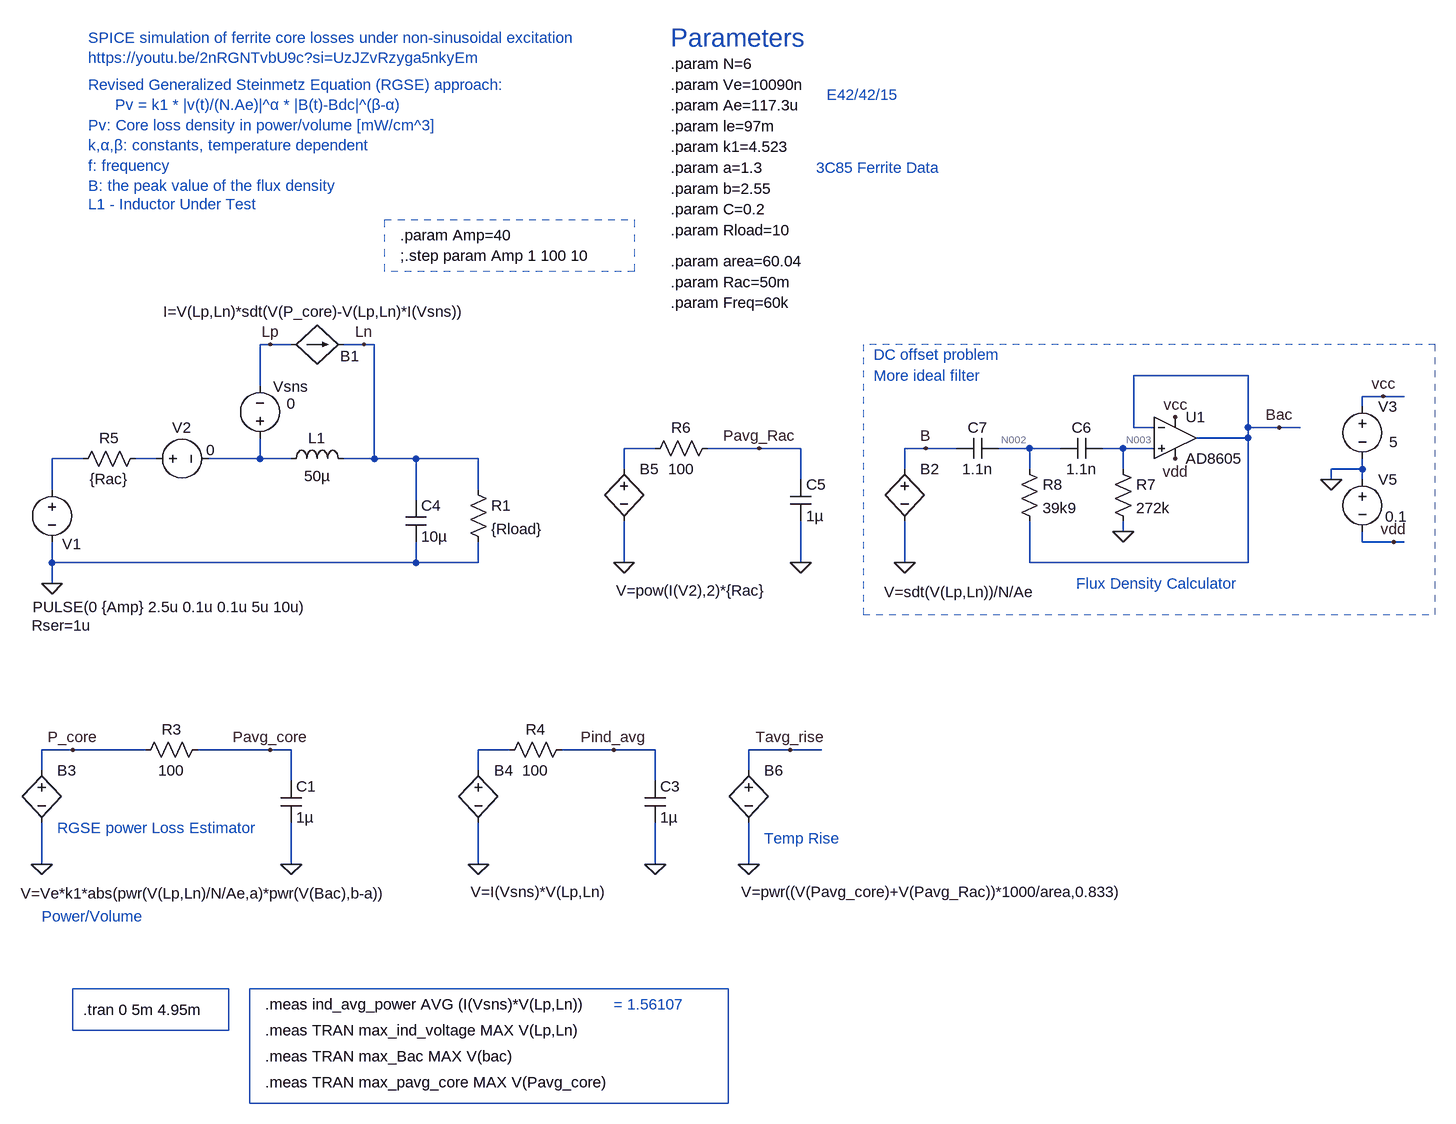
[diagram p0: schematic 08-ferrite_core_loss_max_temp_non-sinsoidal_buck.asc]
08-ferrite_core_loss_max_temp_non-sinsoidal_buck.asc, the LTspice schematic file:
Version 4
SHEET 1 2440 1828
WIRE 144 656 128 656
WIRE 176 656 144 656
WIRE 288 656 256 656
WIRE 304 656 288 656
WIRE 1648 704 1472 704
WIRE 128 720 128 656
WIRE 1856 736 1824 736
WIRE 1888 736 1856 736
WIRE 1824 752 1824 736
WIRE 1472 784 1472 704
WIRE 1504 784 1472 784
WIRE 1648 784 1648 704
WIRE 1696 784 1648 784
WIRE 1728 784 1696 784
WIRE 1648 800 1648 784
WIRE 1648 800 1568 800
WIRE 736 816 688 816
WIRE 896 816 816 816
WIRE 960 816 896 816
WIRE 1152 816 1120 816
WIRE 1200 816 1152 816
WIRE 1312 816 1264 816
WIRE 1360 816 1312 816
WIRE 1456 816 1424 816
WIRE 1504 816 1456 816
WIRE -144 832 -192 832
WIRE -32 832 -64 832
WIRE 128 832 128 800
WIRE 128 832 48 832
WIRE 176 832 128 832
WIRE 304 832 304 656
WIRE 304 832 256 832
WIRE 368 832 304 832
WIRE 464 832 368 832
WIRE 688 848 688 816
WIRE 1120 848 1120 816
WIRE 1312 848 1312 816
WIRE 1456 848 1456 816
WIRE 1824 848 1824 832
WIRE 1824 848 1776 848
WIRE 960 864 960 816
WIRE 1776 864 1776 848
WIRE 1824 864 1824 848
WIRE -192 880 -192 832
WIRE 464 880 464 832
WIRE 368 896 368 832
WIRE 1456 944 1456 928
WIRE 1824 960 1824 944
WIRE 1872 960 1824 960
WIRE 1888 960 1872 960
WIRE -192 992 -192 960
WIRE 368 992 368 960
WIRE 368 992 -192 992
WIRE 464 992 464 960
WIRE 464 992 368 992
WIRE 688 992 688 928
WIRE 960 992 960 928
WIRE 1120 992 1120 928
WIRE 1312 992 1312 928
WIRE 1648 992 1648 800
WIRE 1648 992 1312 992
WIRE -192 1024 -192 992
WIRE -160 1280 -208 1280
WIRE -48 1280 -160 1280
WIRE 144 1280 32 1280
WIRE 176 1280 144 1280
WIRE 512 1280 464 1280
WIRE 672 1280 592 1280
WIRE 736 1280 672 1280
WIRE 944 1280 880 1280
WIRE 992 1280 944 1280
WIRE -208 1312 -208 1280
WIRE 464 1312 464 1280
WIRE 880 1312 880 1280
WIRE 176 1328 176 1280
WIRE 736 1328 736 1280
WIRE -208 1456 -208 1392
WIRE 176 1456 176 1392
WIRE 464 1456 464 1392
WIRE 736 1456 736 1392
WIRE 880 1456 880 1392
FLAG -192 1024 0
FLAG -208 1456 0
FLAG -160 1280 P_core
FLAG 1120 992 0
FLAG 1696 784 Bac
FLAG 144 656 Lp
FLAG 288 656 Ln
FLAG 144 1280 Pavg_core
FLAG 176 1456 0
FLAG 1152 816 B
FLAG 464 1456 0
FLAG 672 1280 Pind_avg
FLAG 736 1456 0
FLAG 688 992 0
FLAG 896 816 Pavg_Rac
FLAG 960 992 0
FLAG 880 1456 0
FLAG 944 1280 Tavg_rise
FLAG 1856 736 vcc
FLAG 1536 768 vcc
FLAG 1456 944 0
FLAG 1776 864 0
FLAG 1872 960 vdd
FLAG 1536 832 vdd
SYMBOL voltage -192 864 R0
WINDOW 0 16 99 Left 2
WINDOW 3 -30 196 Left 2
WINDOW 123 0 0 Left 0
WINDOW 39 -31 225 Left 2
SYMATTR InstName V1
SYMATTR Value PULSE(0 {Amp} 2.5u 0.1u 0.1u 5u 10u)
SYMATTR SpiceLine Rser=1u
SYMBOL ind 160 848 R270
WINDOW 0 32 56 VTop 2
WINDOW 3 5 56 VBottom 2
SYMATTR InstName L1
SYMATTR Value 50µ
SYMATTR SpiceLine Rser=1
SYMBOL bv -208 1296 R0
WINDOW 3 -32 205 Left 2
SYMATTR Value V=Ve*k1*abs(pwr(V(Lp,Ln)/N/Ae,a)*pwr(V(Bac),b-a))
SYMATTR InstName B3
SYMBOL bv 1120 832 R0
WINDOW 3 -32 205 Left 2
SYMATTR Value V=sdt(V(Lp,Ln))/N/Ae
SYMATTR InstName B2
SYMBOL bi 176 656 R270
WINDOW 0 -34 90 VTop 2
WINDOW 3 66 37 VBottom 2
SYMATTR InstName B1
SYMATTR Value I=V(Lp,Ln)*sdt(V(P_core)-V(Lp,Ln)*I(Vsns))
SYMBOL res 48 1264 R90
WINDOW 0 0 56 VBottom 2
WINDOW 3 32 56 VTop 2
SYMATTR InstName R3
SYMATTR Value 100
SYMBOL cap 160 1328 R0
SYMATTR InstName C1
SYMATTR Value 1µ
SYMBOL bv 464 1296 R0
WINDOW 3 -12 203 Left 2
SYMATTR Value V=I(Vsns)*V(Lp,Ln)
SYMATTR InstName B4
SYMBOL res 608 1264 R90
WINDOW 0 0 56 VBottom 2
WINDOW 3 32 56 VTop 2
SYMATTR InstName R4
SYMATTR Value 100
SYMBOL cap 720 1328 R0
SYMATTR InstName C3
SYMATTR Value 1µ
SYMBOL voltage 128 816 R180
WINDOW 0 -74 95 Left 2
WINDOW 3 -55 69 Left 2
SYMATTR InstName Vsns
SYMATTR Value 0
SYMBOL cap 352 896 R0
SYMATTR InstName C4
SYMATTR Value 10µ
SYMBOL res 448 864 R0
SYMATTR InstName R1
SYMATTR Value {Rload}
SYMBOL res -48 816 R90
WINDOW 0 0 56 VBottom 2
WINDOW 3 32 56 VTop 2
SYMATTR InstName R5
SYMATTR Value {Rac}
SYMBOL voltage -48 832 R270
WINDOW 0 32 56 VTop 2
WINDOW 3 29 100 VBottom 2
SYMATTR InstName V2
SYMATTR Value 0
SYMBOL bv 688 832 R0
WINDOW 3 -12 203 Left 2
SYMATTR Value V=pow(I(V2),2)*{Rac}
SYMATTR InstName B5
SYMBOL res 832 800 R90
WINDOW 0 0 56 VBottom 2
WINDOW 3 32 56 VTop 2
SYMATTR InstName R6
SYMATTR Value 100
SYMBOL cap 944 864 R0
SYMATTR InstName C5
SYMATTR Value 1µ
SYMBOL bv 880 1296 R0
WINDOW 3 -12 203 Left 2
SYMATTR Value V=pwr((V(Pavg_core)+V(Pavg_Rac))*1000/area,0.833)
SYMATTR InstName B6
SYMBOL voltage 1824 736 R0
WINDOW 3 41 70 Left 2
WINDOW 123 0 0 Left 0
WINDOW 39 0 0 Left 0
SYMATTR InstName V3
SYMATTR Value 5
SYMBOL res 1440 832 R0
SYMATTR InstName R7
SYMATTR Value 272k
SYMBOL cap 1424 800 R90
WINDOW 0 0 32 VBottom 2
WINDOW 3 32 32 VTop 2
SYMATTR InstName C6
SYMATTR Value 1.1n
SYMBOL res 1296 832 R0
SYMATTR InstName R8
SYMATTR Value 39k9
SYMBOL cap 1264 800 R90
WINDOW 0 0 32 VBottom 2
WINDOW 3 32 32 VTop 2
SYMATTR InstName C7
SYMATTR Value 1.1n
SYMBOL voltage 1824 848 R0
WINDOW 3 35 73 Left 2
WINDOW 123 0 0 Left 0
WINDOW 39 0 0 Left 0
SYMATTR InstName V5
SYMATTR Value 0.1
SYMBOL OpAmps\\AD8605 1536 736 R0
SYMATTR InstName U1
TEXT -136 184 Left 2 ;SPICE simulation of ferrite core losses under non-sinusoidal excitation\nhttps://youtu.be/2nRGNTvbU9c?si=UzJZvRzyga5nkyEm
TEXT -136 256 Left 2 ;Revised Generalized Steinmetz Equation (RGSE) approach:\n      Pv = k1 * |v(t)/(N.Ae)|^α * |B(t)-Bdc|^(β-α)\nPv: Core loss density in power/volume [mW/cm^3]\nk,α,β: constants, temperature dependent\nf: frequency\nB: the peak value of the flux density
TEXT 760 224 Left 2 !.param N=6
TEXT 760 184 Left 4 ;Parameters
TEXT 760 256 Left 2 !.param Ve=10090n
TEXT 760 288 Left 2 !.param Ae=117.3u
TEXT 760 320 Left 2 !.param le=97m
TEXT 760 352 Left 2 !.param k1=4.523
TEXT 760 384 Left 2 !.param a=1.3
TEXT 760 416 Left 2 !.param b=2.55
TEXT 344 488 Left 2 !.param Amp=40\n;.step param Amp 1 100 10
TEXT 1000 272 Left 2 ;E42/42/15
TEXT 984 384 Left 2 ;3C85 Ferrite Data
TEXT -144 1680 Left 2 !.tran 0 5m 4.95m
TEXT -184 1400 Left 2 ;RGSE power Loss Estimator
TEXT 1384 1024 Left 2 ;Flux Density Calculator
TEXT -208 1536 Left 2 ;Power/Volume
TEXT -136 440 Left 2 ;L1 - Inductor Under Test
TEXT 136 1672 Left 2 !.meas ind_avg_power AVG (I(Vsns)*V(Lp,Ln))
TEXT 672 1672 Left 2 ;= 1.56107
TEXT 136 1712 Left 2 !.meas TRAN max_ind_voltage MAX V(Lp,Ln)
TEXT 136 1752 Left 2 !.meas TRAN max_Bac MAX V(bac)
TEXT 136 1792 Left 2 !.meas TRAN max_pavg_core MAX V(Pavg_core)
TEXT 760 448 Left 2 !.param C=0.2
TEXT 760 480 Left 2 !.param Rload=10
TEXT 760 528 Left 2 !.param area=60.04
TEXT 760 560 Left 2 !.param Rac=50m
TEXT 760 592 Left 2 !.param Freq=60k
TEXT 904 1416 Left 2 ;Temp Rise
TEXT 1072 672 Left 2 ;DC offset problem
TEXT 1072 704 Left 2 ;More ideal filter
RECTANGLE Normal 80 1712 -160 1648
RECTANGLE Normal 848 1824 112 1648
RECTANGLE Normal 704 544 320 464 1
RECTANGLE Normal 1056 1072 1936 656 2

The netlist it stands for:
* 08-ferrite_core_loss_max_temp_non-sinsoidal_buck.asc
V1 N004 0 PULSE(0 {Amp} 2.5u 0.1u 0.1u 5u 10u) Rser=1u
L1 N006 Ln 50µ Rser=1
B3 P_core 0 V=Ve*k1*abs(pwr(V(Lp,Ln)/N/Ae,a)*pwr(V(Bac),b-a))
B2 B 0 V=sdt(V(Lp,Ln))/N/Ae
B1 Lp Ln I=V(Lp,Ln)*sdt(V(P_core)-V(Lp,Ln)*I(Vsns))
R3 Pavg_core P_core 100
C1 Pavg_core 0 1µ
B4 N007 0 V=I(Vsns)*V(Lp,Ln)
R4 Pind_avg N007 100
C3 Pind_avg 0 1µ
Vsns N006 Lp 0
C4 Ln 0 10µ
R1 Ln 0 {Rload}
R5 N005 N004 {Rac}
V2 N005 N006 0
B5 N001 0 V=pow(I(V2),2)*{Rac}
R6 Pavg_Rac N001 100
C5 Pavg_Rac 0 1µ
B6 Tavg_rise 0 V=pwr((V(Pavg_core)+V(Pavg_Rac))*1000/area,0.833)
V3 vcc 0 5
R7 N003 0 272k
C6 N003 N002 1.1n
R8 N002 Bac 39k9
C7 N002 B 1.1n
V5 0 vdd 0.1
XU1 N003 Bac vcc vdd Bac AD8605  ; pins In+ In- V+ V- OUT
* SPICE simulation of ferrite core losses under non-sinusoidal excitation
* https://youtu.be/2nRGNTvbU9c?si=UzJZvRzyga5nkyEm
* Revised Generalized Steinmetz Equation (RGSE) approach:
*       Pv = k1 * |v(t)/(N.Ae)|^α * |B(t)-Bdc|^(β-α)
* Pv: Core loss density in power/volume [mW/cm^3]
* k,α,β: constants, temperature dependent
* f: frequency
* B: the peak value of the flux density
.param N=6
* Parameters
.param Ve=10090n
.param Ae=117.3u
.param le=97m
.param k1=4.523
.param a=1.3
.param b=2.55
.param Amp=40
;.step param Amp 1 100 10
* E42/42/15
* 3C85 Ferrite Data
.tran 0 5m 4.95m
* RGSE power Loss Estimator
* Flux Density Calculator
* Power/Volume
* L1 - Inductor Under Test
.meas ind_avg_power AVG (I(Vsns)*V(Lp,Ln))
* = 1.56107
.meas TRAN max_ind_voltage MAX V(Lp,Ln)
.meas TRAN max_Bac MAX V(bac)
.meas TRAN max_pavg_core MAX V(Pavg_core)
.param C=0.2
.param Rload=10
.param area=60.04
.param Rac=50m
.param Freq=60k
* Temp Rise
* DC offset problem
* More ideal filter
.lib ADI.lib
.backanno
.end

* Results of the author's LTspice run, read from the files saved beside the schematic
* Operating Point, zero values left out:
*   V(vcc) = 5 V
*   V(n003) = -13.6 nV
*   V(n002) = -105.2 µV
*   V(bac) = -105.2 µV
*   V(vdd) = -100 mV
*   I(V3) = -492.8 µA
*   I(V5) = -492.8 µA
*   Ix(u1:99) = 492.8 µA
*   Ix(u1:50) = -492.8 µA
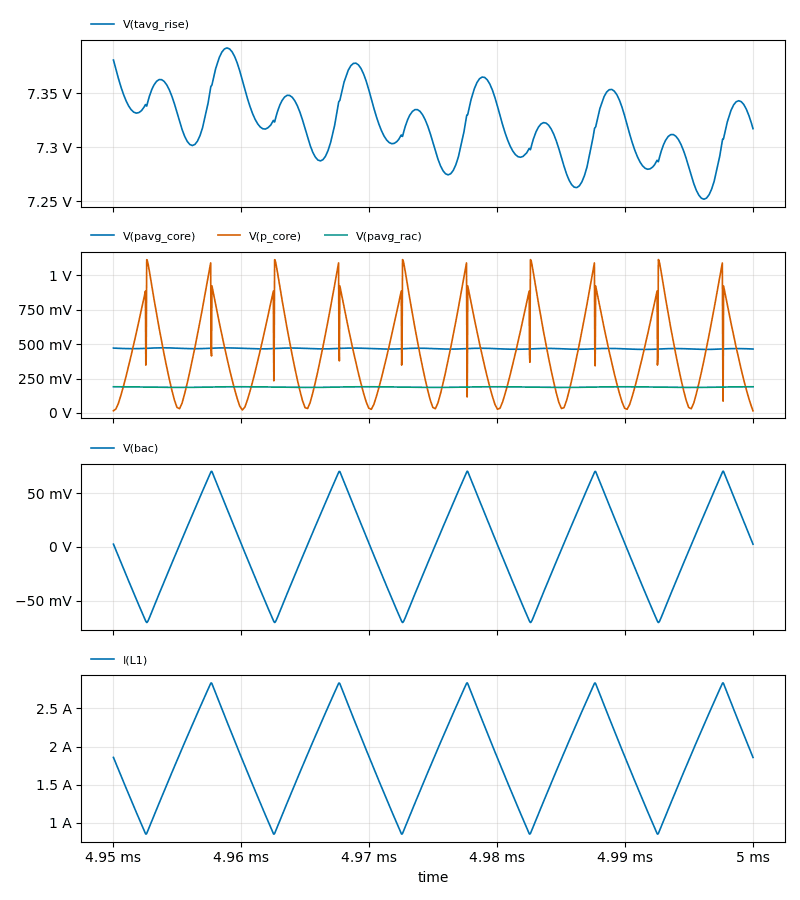
[diagram p1: Transient Analysis of 08-ferrite_core_loss_max_temp_non-sinsoidal_buck.asc, plotted from the saved traces]
* Transient Analysis, 1 run:
*   V(tavg_rise): min 7.252 V, max 7.392 V, average 7.321 V, rms 7.322 V, last 7.317 V
*   V(pavg_core): min 461.8 mV, max 473.4 mV, average 467.4 mV, rms 467.4 mV, last 464.7 mV
*   V(p_core): min 14.9 mV, max 1.115 V, average 458 mV, rms 551.3 mV, last 14.9 mV
*   V(pavg_rac): min 185.4 mV, max 190.3 mV, average 187.8 mV, rms 187.8 mV, last 190.1 mV
*   V(bac): min -70.13 mV, max 70.37 mV, average -139.8 µV, rms 41.24 mV, last 2.571 mV
*   I(L1): min 852.9 mA, max 2.836 A, average 1.845 A, rms 1.934 A, last 1.859 A
* From the log:
*   ind_avg_power: AVG(i(vsns)*v(lp,ln))=0.47415 FROM 0 TO 5e-05
*   max_ind_voltage: MAX(v(lp,ln))=21.5751 FROM 0 TO 5e-05
*   max_bac: MAX(v(bac))=0.0703658 FROM 0 TO 5e-05
*   max_pavg_core: MAX(v(pavg_core))=0.473351 FROM 0 TO 5e-05